# EAGLE design skyshieldv0.4 (EAGLE 7.2.0)
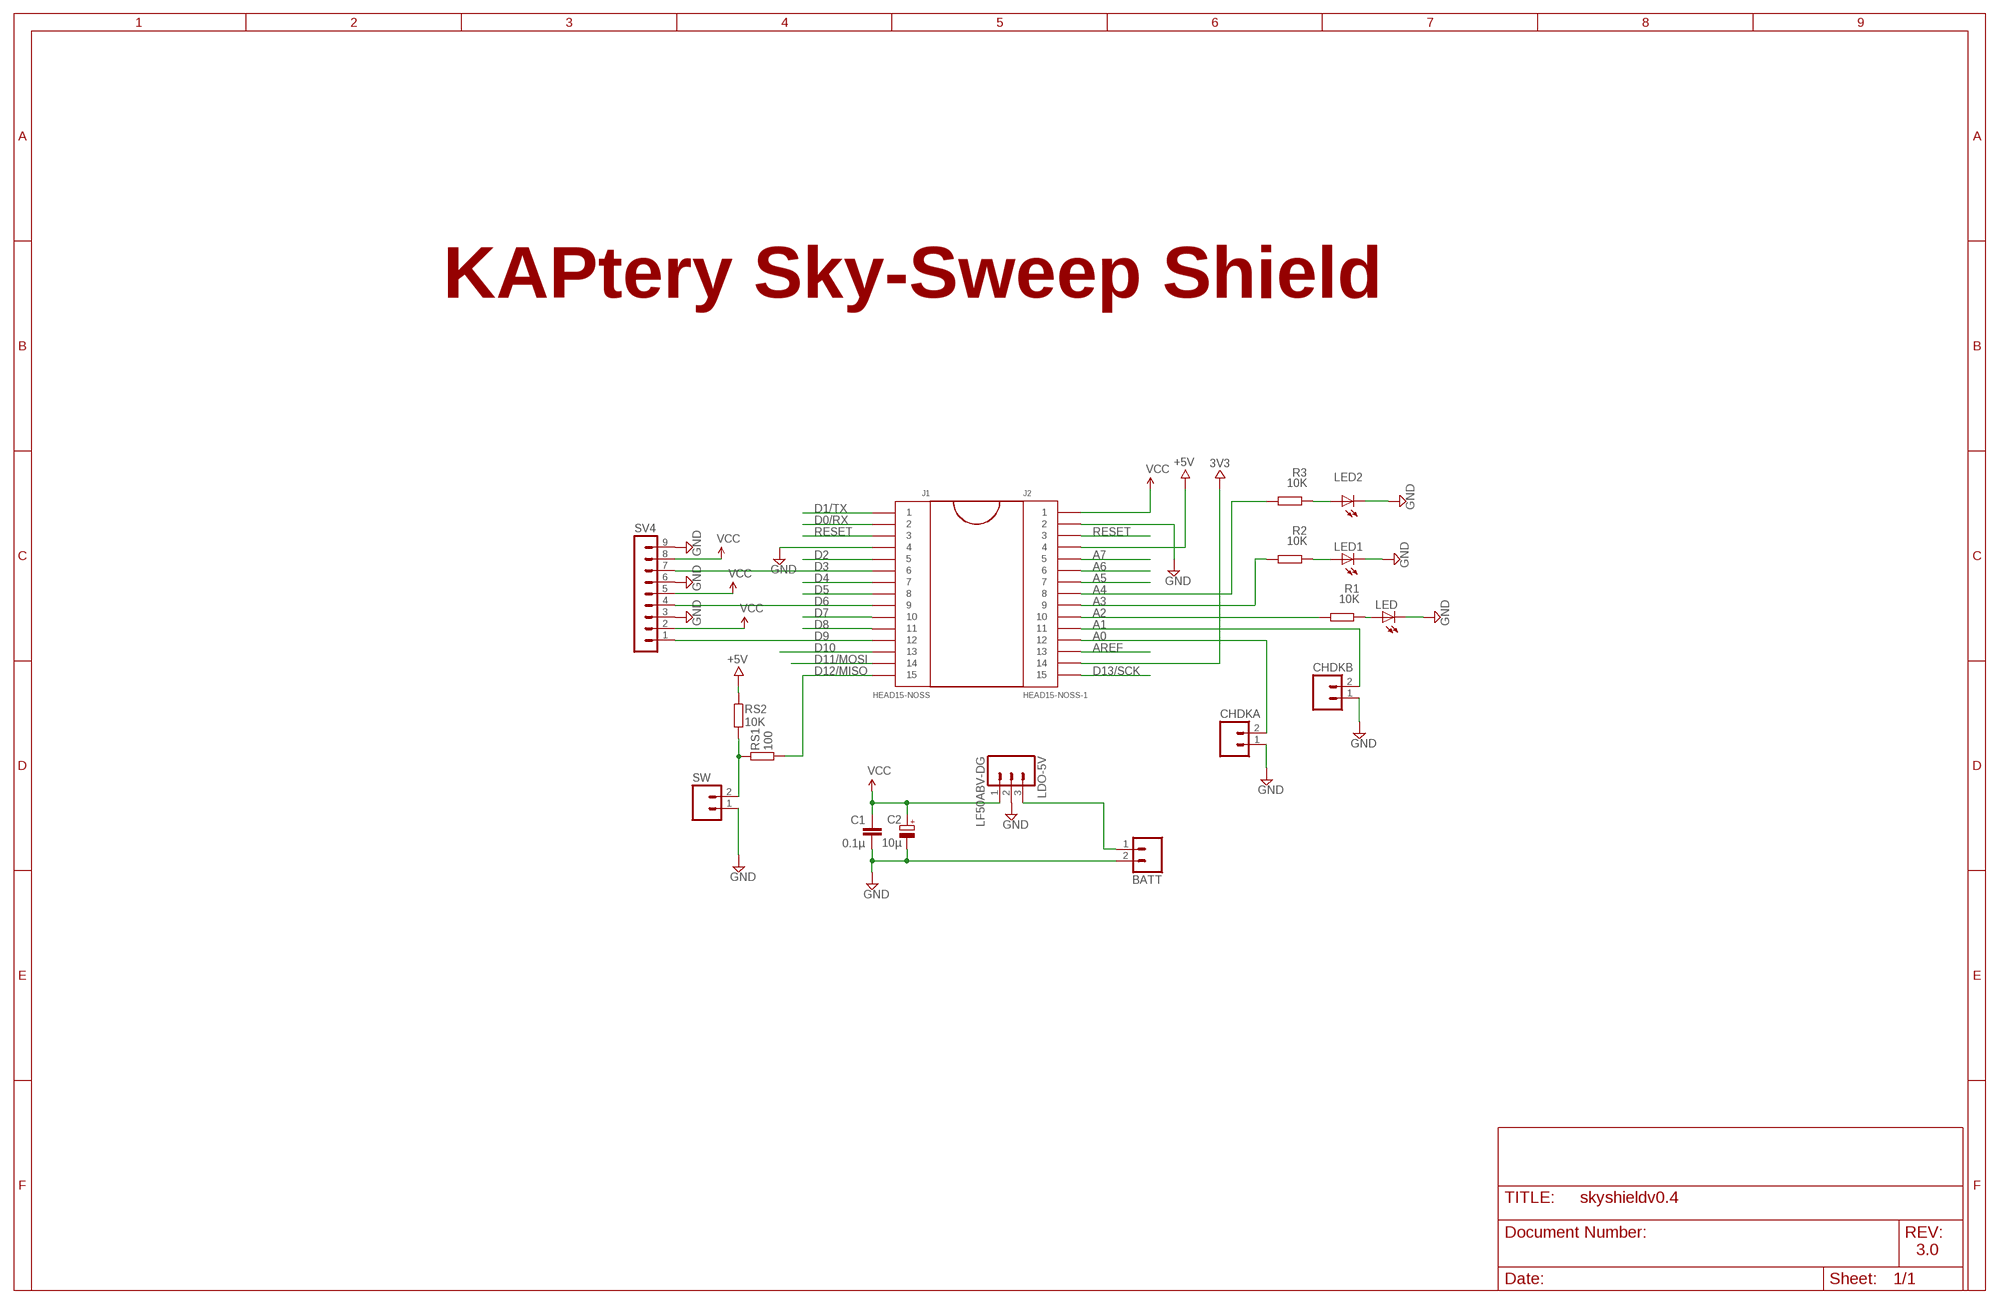
[diagram p0: schematic, sheet 1]

## Parts
BATT  M02PTH  [1X02]
C1  0.1µ  C-EU025-024X044  [C025-024X044]
C2  10µ  CPOL-EUE1.8-4  [E1,8-4]
CHDKA  M02PTH  [1X02]
CHDKB  M02PTH  [1X02]
J1  HEAD15-NOSS  [HEAD15-NOSS]
J2  HEAD15-NOSS-1  [HEAD15-NOSS-1]
LDO-5V  LF50ABV-DG  M03PTH  [1X03]
LED  POWERLED  LED3MM  [LED3MM]
LED1  POWERLED  LED3MM  [LED3MM]
LED2  POWERLED  LED3MM  [LED3MM]
R1  10K  R-EU_0204/7  [0204/7]
R2  10K  R-EU_0204/7  [0204/7]
R3  10K  R-EU_0204/7  [0204/7]
RS1  100  R-EU_0204/7  [0204/7]
RS2  10K  R-EU_0204/7  [0204/7]
SV4  MA09-1  [MA09-1]
SW  M02PTH  [1X02]

## Nets
3V3: J2.14
+5V: J2.4 RS2.1
A0: CHDKA.2 J2.12
A1: CHDKB.2 J2.11
A2: J2.10 R1.1
A3: J2.9 R2.1
A4: J2.8 R3.1
A5: J2.7
A6: J2.6
A7: J2.5
AREF: J2.13
D0/RX: J1.2
D1/TX: J1.1
D2: J1.5
D3: J1.6 SV4.7
D4: J1.7
D5: J1.8
D6: J1.9 SV4.4
D7: J1.10
D8: J1.11
D9: J1.12 SV4.1
D10: J1.13
D11/MOSI: J1.14
D12/MISO: J1.15 RS1.2
D13/SCK: J2.15
GND [power]: BATT.2 C1.2 C2.- CHDKA.1 CHDKB.1 J1.4 J2.2 LDO-5V.2 LED1.K(C) LED2.K(C) LED.K(C) SV4.3 SV4.6 SV4.9 SW.1
N$1: LED2.A R3.2
N$2: LED1.A R2.2
N$3: LED.A R1.2
N$4: RS1.1 RS2.2 SW.2
N$6: BATT.1 LDO-5V.3
RESET: J1.3 J2.3
VCC [power]: C1.1 C2.+ J2.1 LDO-5V.1 SV4.2 SV4.5 SV4.8

## Notes on the sheet
- KAPtery Sky-Sweep Shield
- 3.0

## Library data of the parts
BATT CHDKA CHDKB SW = SparkFun-Connectors:M02: Standard 2-pin 0.1" header. Use with - straight break away headers ( PRT-00116) - right angle break away headers (PRT-00553) - swiss pins (PRT-00743) - machine pins (PRT-00117) - female headers (PRT-00115) Molex polarized connector foot print use with: PRT-08233 with associated crimp pins and housings. 2.54_SCREWTERM for use with PRT-10571. 3.5mm Screw Terminal footprints for PRT-08084 5mm Screw Terminal footprints for use with PRT-08432
C1 = resistor:C-EU: CAPACITOR, European symbol
C2 = resistor:CPOL-EU: POLARIZED CAPACITOR, European symbol
J1 = MyCON2:HEAD15-NOSS
J2 = MyCON2:HEAD15-NOSS-1
LDO-5V = SparkFun-Connectors:M03: Header 3 Standard 3-pin 0.1" header. Use with straight break away headers (SKU : PRT-00116), right angle break away headers (PRT-00553), swiss pins (PRT-00743), machine pins (PRT-00117), and female headers (PRT-00115). Molex polarized connector foot print use with SKU : PRT-08232 with associated crimp pins and housings.
LED LED1 LED2 = adafruit:LED: LED OSRAM: - CHIPLED LG R971, LG N971, LY N971, LG Q971, LY Q971, LO R971, LY R971 LH N974, LH R974 LS Q976, LO Q976, LY Q976 LO Q996 - Hyper CHIPLED LW Q18S LB Q993, LB Q99A, LB R99A - SideLED LS A670, LO A670, LY A670, LG A670, LP A670 LB A673, LV A673, LT A673, LW A673 LH A674 LY A675 LS A676, LA A676, LO A676, LY A676, LW A676 LS A679, LY A679, LG A679 - Hyper Micro SIDELED® LS Y876, LA Y876, LO Y876, LY Y876 LT Y87S - SmartLED LW L88C, LW L88S LB L89C, LB L89S, LG L890 LS L89K, LO L89K, LY L89K LS L896, LA L896, LO L896, LY L896 - TOPLED LS T670, LO T670, LY T670, LG T670, LP T670 LSG T670, LSP T670, LSY T670, LOP T670, LYG T670 LG T671, LOG T671, LSG T671 LB T673, LV T673, LT T673, LW T673 LH T674 LS T676, LA T676, LO T676, LY T676, LB T676, LH T676, LSB T676, LW T676 LB T67C, LV T67C, LT T67C, LS T67K, LO T67K, LY T67K, LW E67C LS E67B, LA E67B, LO E67B, LY E67B, LB E67C, LV E67C, LT E67C LW T67C LS T679, LY T679, LG T679 LS T770, LO T770, LY T770, LG T770, LP T770 LB T773, LV T773, LT T773, LW T773 LH T774 LS E675, LA E675, LY E675, LS T675 LS T776, LA T776, LO T776, LY T776, LB T776 LHGB T686 LT T68C, LB T68C - Hyper Mini TOPLED® LB M676 - Mini TOPLED Santana® LG M470 LS M47K, LO M47K, LY M47K Source: http://www.osram.convergy.de/
R1-R3 RS1 RS2 = rcl:R-EU_: RESISTOR, European symbol
SV4 = con-lstb:MA09-1: PIN HEADER; OC_FARNELL: unknown; OC_NEWARK: unknown

## Net classes
0 default: width 0.406 mm, clearance 0.203 mm
1 power: width 0.813 mm, clearance 0.203 mm

## Board
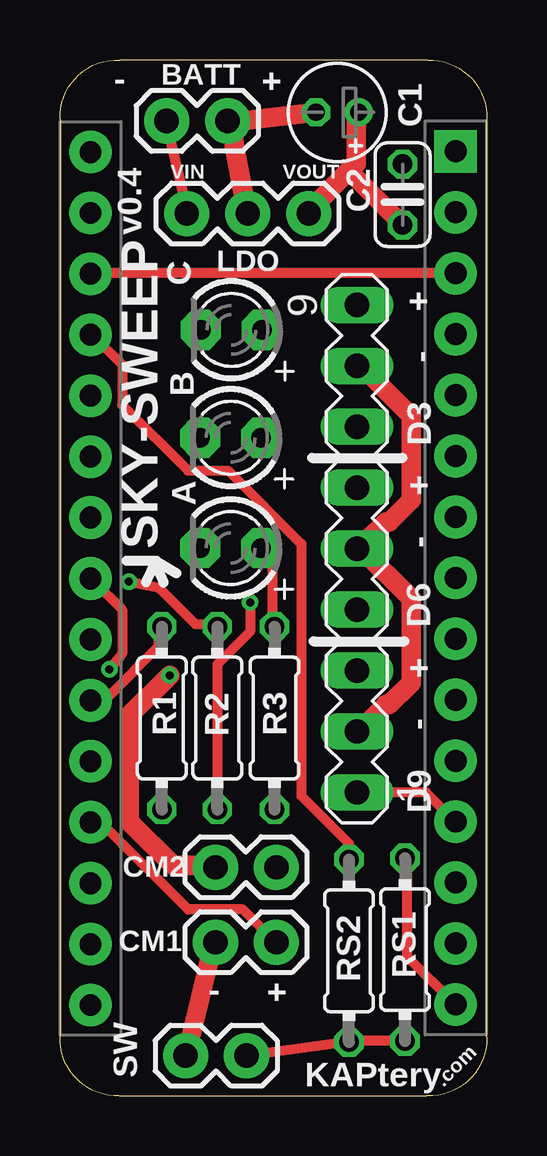
[diagram p1: board, top side]
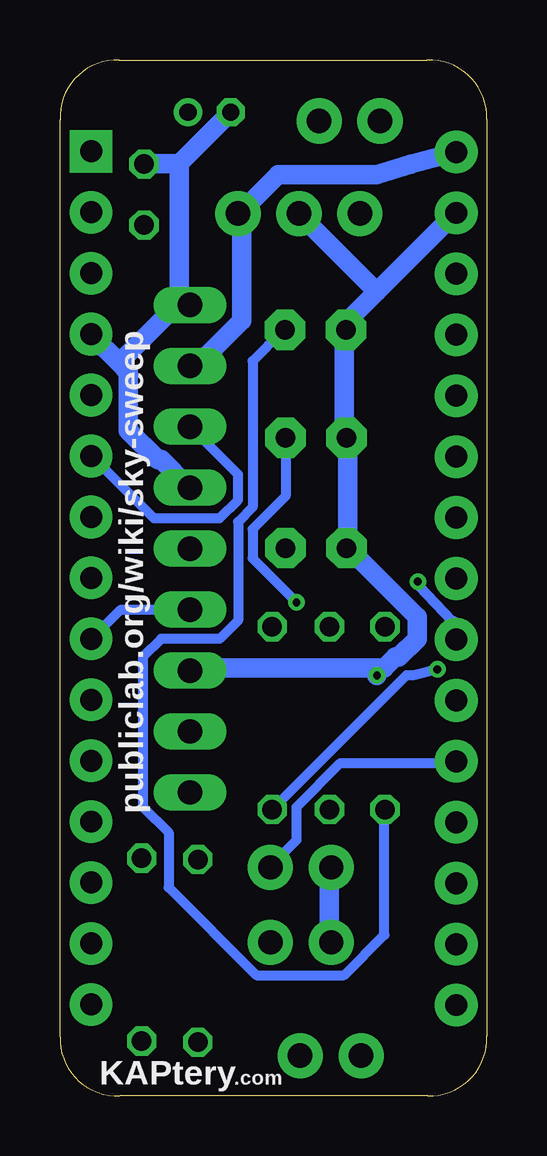
[diagram p2: board, bottom side, seen from below]

Size 17.78 x 43.18 mm. Coordinates in mm from the lower left corner, seen from the top.
Outline: 2.46,0 15.29,0 arc94 17.78,2.46 17.78,40.69 arc94 15.32,43.18 2.49,43.18 arc94 0,40.72 0,2.49 arc94 2.46,0
Copper layers (1*16): Top 0.0356mm / dielectric 1.5011mm / Bottom 0.0356mm
Design rules "LaenPCBOrder": minimum track width 6mil, minimum drill 13mil, track to track 6mil, track to pad 6mil, pad to pad 6mil, via to via 6mil, smd to smd 6mil, copper to edge 15mil, drill to drill 6mil, minimum pad ring 7mil, minimum via ring 7mil, stop-mask expansion 3mil, vias tented up to drill 0mil, thermal gap 10mil

### Footprints (pad centres in the part's own frame; a part is rotated, then mirrored left to right if it is on the bottom)
1X02 = drill 1.016 pad 1.88: 1 0,0; 2 2.54,0
C025-024X044 = drill 0.813 octagon: 1 -1.27,0; 2 1.27,0
E1,8-4 = drill 0.711 pad 1.168: + -0.889,0 | drill 0.711 pad 1.168 octagon: - 0.889,0
HEAD15-NOSS = drill 0.914 pad 1.778 square: 1 0,0 | drill 0.914 pad 1.778: 2 2.54,0; 3 5.08,0; 4 7.62,0; 5 10.16,0; 6 12.7,0; 7 15.24,0; 8 17.78,0; 9 20.32,0; 10 22.86,0; 11 25.4,0; 12 27.94,0; 13 30.48,0; 14 33.02,0; 15 35.56,0
HEAD15-NOSS-1 = drill 0.914 pad 1.778: 1 0,0; 2 2.54,0; 3 5.08,0; 4 7.62,0; 5 10.16,0; 6 12.7,0; 7 15.24,0; 8 17.78,0; 9 20.32,0; 10 22.86,0; 11 25.4,0; 12 27.94,0; 13 30.48,0; 14 33.02,0; 15 35.56,0
1X03 = drill 1.016 pad 1.88: 1 0,0; 2 2.54,0; 3 5.08,0
LED3MM = drill 0.813 pad 1.676 octagon: A -1.27,0; K 1.27,0
0204/7 = drill 0.813 octagon: 1 -3.81,0; 2 3.81,0
MA09-1 = drill 1.016 long: 1 -10.16,0; 2 -7.62,0; 3 -5.08,0; 4 -2.54,0; 5 0,0; 6 2.54,0; 7 5.08,0; 8 7.62,0; 9 10.16,0

### Placement (x,y rotation side)
BATT  4.45,40.64 0 top
C1  14.27,37.57 90 top
C2  11.56,41 180 top
CHDKA  6.48,6.4 0 top
CHDKB  6.48,9.53 0 top
J1  16.48,39.37 270 top
J2  1.27,39.34 270 top
LDO-5V  10.36,36.78 180 top
LED  7.14,31.93 180 top
LED1  7.11,27.43 180 top
LED2  7.11,22.83 180 top
R1  4.24,15.75 270 top
R2  6.55,15.75 270 top
R3  8.94,15.75 90 top
RS1  14.38,6.1 90 top
RS2  12.04,6.05 270 top
SV4  12.37,22.81 90 top
SW  5.23,1.68 0 top

### Tracks (layer width: path | path; a pad name or v marks a point on that pad's centre or on a via)
+5V
  Top 0.406: RS2.1 12.04,10.52 10.06,12.5 10.06,23.01 7.01,26.06 5.33,26.06 2.59,28.8 2.59,30.48 1.37,31.7 J2.4
A0
  Top 0.406: J2.12 1.37,11.28 1.83,11.28 5.33,7.77 7.62,7.77 8.99,6.4 CHDKA.2
A1
  Bottom 0.406: J2.11 1.37,13.87 6.1,13.87 7.92,12.04 7.92,10.67 8.99,9.6 CHDKB.2
A2
  Top 0.406: R1.1 4.12,19.51 4.12,18.75 1.98,16.61 1.37,16.61 J2.10
A3  (via drill 0.33)
  Top 0.406: v2.87,21.44 4.12,21.18 5.64,19.66 6.55,19.66 R2.1
  Bottom 0.406: v2.87,21.44 2.82,21.23 1.45,19.79 1.37,19.79 1.27,19.05 J2.9
A4  (via drill 0.33)
  Top 0.406: v2.06,17.78 2.49,18.29 2.59,18.44 2.59,20.27 1.37,21.49 J2.8
  Bottom 0.406: R3.1 3.35,17.53 3.05,17.53 v2.06,17.78
D3
  Bottom 0.406: SV4.7 12.34,27.89 10.36,25.91 10.36,24.84 11.12,24.08 13.87,24.08 16.46,26.67 J1.6
D6
  Bottom 0.406: SV4.4 15.24,20.27 16.46,19.05 J1.9
D9
  Top 0.406: SV4.1 15.24,12.65 16.46,11.43 J1.12
D12/MISO
  Top 0.406: RS1.2 14.48,9.91 14.48,5.79 16.46,3.81 J1.15
GND  (via drill 0.33)
  Top 0.813: C2.- 7.85,40.66 7.64,40.69 BATT.2 7.24,40.03 7.26,39.6 7.77,36.88 LDO-5V.2 | SW.1 5.28,1.75 6.12,5.21 6.4,6.4 CHDKA.1 | v4.57,17.53 2.9,15.85 2.9,11.43 4.72,9.6 6.4,9.6 CHDKB.1
  Bottom 0.813: 15.32,30.56 16.46,31.7 J1.4 | 15.32,30.56 14.94,30.18 14.94,27.74 13.72,26.52 13.56,26.52 12.5,25.45 SV4.6 | 15.32,30.56 12.95,32.92 12.5,32.92 SV4.9 12.8,33.22 12.8,38.86 | 12.8,38.86 14.17,38.86 C1.2 | C2.- 12.8,38.86 | CHDKB.1 6.55,9.45 6.55,6.4 CHDKA.1 | 4.57,17.83 4.27,17.83 3.81,18.29 3.66,18.29 2.9,19.05 2.9,19.96 5.79,22.86 LED2.K 5.79,23.16 5.79,27.43 LED1.K 5.94,27.74 5.94,31.85 LED.K 5.79,32.31 4.57,33.53 | 4.57,17.83 12.34,17.83 SV4.3 | 4.57,33.53 1.37,36.73 J2.2 | v4.57,17.53 4.57,17.83 | 4.57,33.53 LDO-5V.2
N$1
  Top 0.406: R3.2 8.84,19.66 8.84,22.25 8.38,22.71 LED2.A
N$2  (via drill 0.33)
  Top 0.406: R2.2 6.55,17.98 7.92,19.36 v7.92,20.57
  Bottom 0.406: v7.92,20.57 9.75,22.4 9.75,23.62 8.38,24.99 LED1.A
N$3
  Bottom 0.406: R1.2 4.27,11.89 4.27,6.71 5.94,5.03 9.6,5.03 13.26,8.69 13.26,10.97 14.33,12.04 14.33,18.29 13.56,19.05 11.12,19.05 10.36,19.81 10.36,23.93 9.75,24.54 9.75,30.63 8.53,31.85 LED.A
N$4
  Top 0.406: RS1.1 12.04,2.29 RS2.2 11.43,2.18 8.1,1.73 SW.2
N$6
  Top 0.406: LDO-5V.3 5.21,37.36 4.5,40.39 BATT.1
RESET
  Top 0.406: J1.3 1.37,34.29 J2.3
VCC
  Top 0.813: SV4.2 12.5,15.24 13.56,16.31 13.72,16.31 14.63,17.22 14.63,20.73 12.5,22.86 SV4.5 12.8,23.16 13.56,23.93 13.72,23.93 14.63,24.84 14.63,28.35 12.5,30.48 SV4.8 | 12.04,38.56 10.36,36.88 LDO-5V.1 | 12.04,38.56 12.34,38.86 12.34,41 C2.+ | 12.04,38.56 14.17,36.42 C1.1
  Bottom 0.813: SV4.8 12.34,30.48 12.04,30.48 10.21,32.31 10.21,36.58 10.36,36.73 LDO-5V.1 10.06,37.03 8.69,38.41 4.57,38.41 3.17,38.84 1.37,39.32 J2.1

### Text on the board
tPlace: BATT | + | - | C1 | v0.4 | VIN | VOUT | C2 | C | LDO | + | - | B | D3 | A | + | SKY-SWEEP | - | D6 | + | - | R1 | R2 | R3 | D9 | CM2 | CM1 | RS2 | RS1 | - | + | SW | KAPtery | .com
bPlace: publiclab.org/wiki/sky-sweep | KAPtery | .com